# EAGLE design Driver Board v2 (EAGLE 9.6.2)
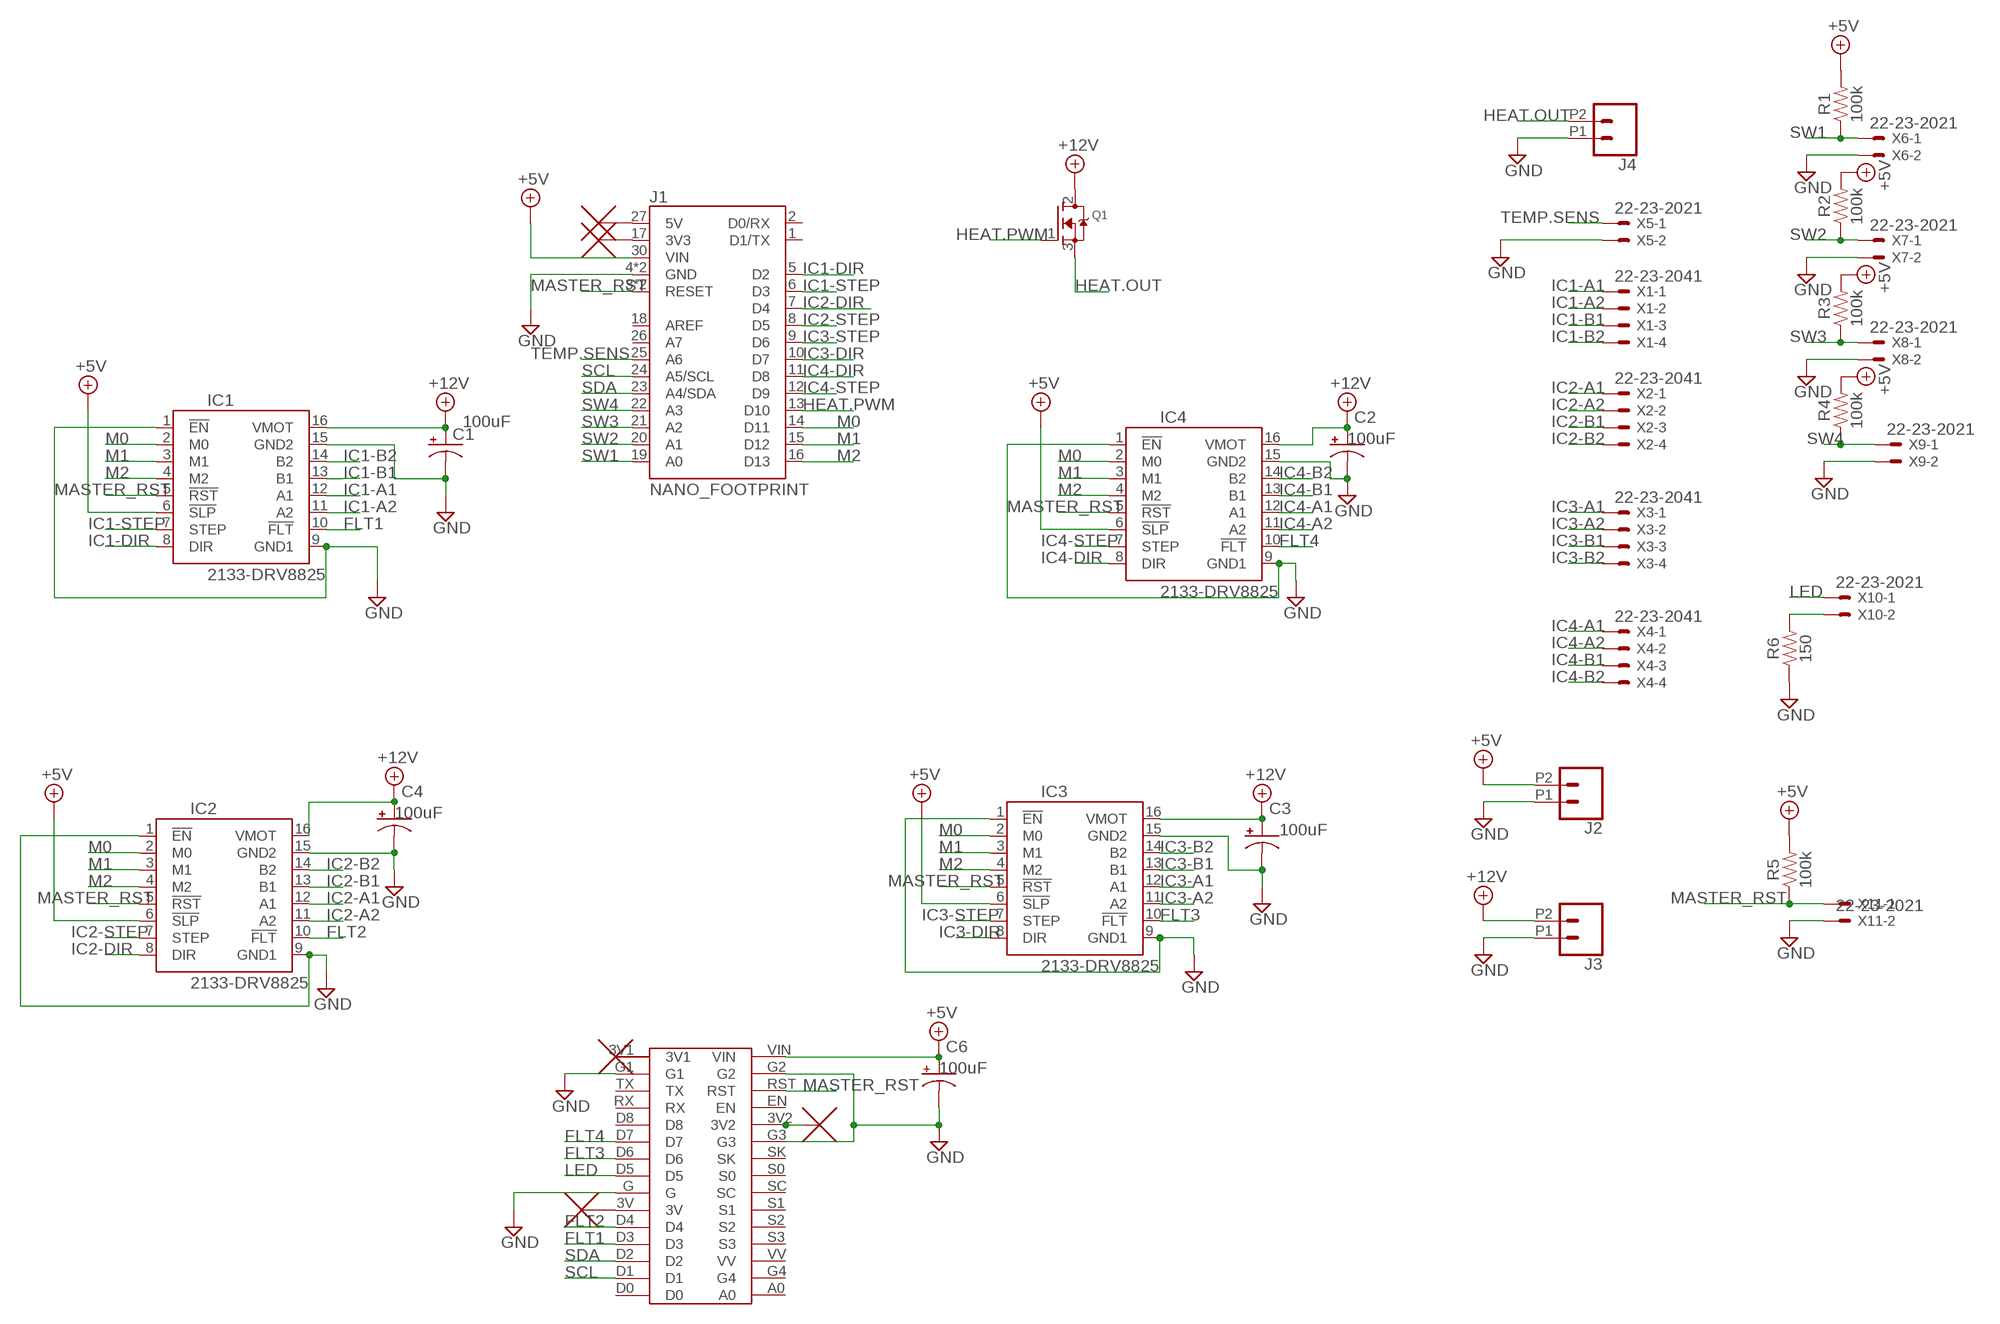
[diagram p0: schematic, sheet 1]

## Parts
C1  CPOL-USD  [PANASONIC_D]
C2  CPOL-USD  [PANASONIC_D]
C3  CPOL-USD  [PANASONIC_D]
C4  CPOL-USD  [PANASONIC_D]
C6  CPOL-USD  [PANASONIC_D]
IC1  2133-DRV8825  [DRV8825]
IC2  2133-DRV8825  [DRV8825]
IC3  2133-DRV8825  [DRV8825]
IC4  2133-DRV8825  [DRV8825]
J1  NANO_FOOTPRINT  [NANO]
J2  CONN_02SCREWTERMINAL-6.35MM-2  [1X02_6.35_SCREWTERM]
J3  CONN_02SCREWTERMINAL-6.35MM-2  [1X02_6.35_SCREWTERM]
J4  CONN_02SCREWTERMINAL-6.35MM-2  [1X02_6.35_SCREWTERM]
Q1  MOSFET-NGDS_TO220V  [TO220V]
R1  100k  0.22OHM-0805-1/4W-1%  [0805]
R2  100k  0.22OHM-0805-1/4W-1%  [0805]
R3  100k  0.22OHM-0805-1/4W-1%  [0805]
R4  100k  0.22OHM-0805-1/4W-1%  [0805]
R5  100k  0.22OHM-0805-1/4W-1%  [0805]
R6  150  0.22OHM-0805-1/4W-1%  [0805]
U$4  NC_MARKER  (no package)
U$5  NC_MARKER  (no package)
U$6  LOLIN  [LOLIN]
U$7  NC_MARKER  (no package)
U$8  NC_MARKER  (no package)
U$9  NC_MARKER  (no package)
X1  22-23-2041  [22-23-2041]
X2  22-23-2041  [22-23-2041]
X3  22-23-2041  [22-23-2041]
X4  22-23-2041  [22-23-2041]
X5  22-23-2021  [22-23-2021]
X6  22-23-2021  [22-23-2021]
X7  22-23-2021  [22-23-2021]
X8  22-23-2021  [22-23-2021]
X9  22-23-2021  [22-23-2021]
X10  22-23-2021  [22-23-2021]
X11  22-23-2021  [22-23-2021]

## Nets
+5V: IC1.6(!SLP) IC2.6(!SLP) IC3.6(!SLP) IC4.6(!SLP) J1.30(VIN) J2.P2 R1.2 R2.2 R3.2 R4.2 R5.2
+5V1: C6.+ U$6.VIN ; supply symbol labelled +5V
+12V: C1.+ C2.+ C3.+ C4.+ IC1.16(VMOT) IC2.16(VMOT) IC3.16(VMOT) IC4.16(VMOT) J3.P2 Q1.2(D)
FLT1: IC1.10(!FLT) U$6.D3
FLT2: IC2.10(!FLT) U$6.D4
FLT3: IC3.10(!FLT) U$6.D6
FLT4: IC4.10(!FLT) U$6.D7
GND: C1.- C2.- C3.- C4.- IC1.1(!EN) IC1.9(GND1) IC1.15(GND2) IC2.1(!EN) IC2.9(GND1) IC2.15(GND2) IC3.1(!EN) IC3.9(GND1) IC3.15(GND2) IC4.1(!EN) IC4.9(GND1) IC4.15(GND2) J1.4(GND) J1.29(GND) J2.P1 J3.P1 J4.P1 R6.1 U$6.G U$6.G1 X5.2 X6.2 X7.2 X8.2 X9.2 X11.2
GND1: C6.- U$6.G2 U$6.G3 ; supply symbol labelled GND
HEAT.OUT: J4.P2 Q1.3(S)
HEAT.PWM: J1.13(D10) Q1.1(G)
IC1-A1: IC1.12(A1) X1.1
IC1-A2: IC1.11(A2) X1.2
IC1-B1: IC1.13(B1) X1.3
IC1-B2: IC1.14(B2) X1.4
IC1-DIR: IC1.8(DIR) J1.5(D2)
IC1-STEP: IC1.7(STEP) J1.6(D3)
IC2-A1: IC2.12(A1) X2.1
IC2-A2: IC2.11(A2) X2.2
IC2-B1: IC2.13(B1) X2.3
IC2-B2: IC2.14(B2) X2.4
IC2-DIR: IC2.8(DIR) J1.7(D4)
IC2-STEP: IC2.7(STEP) J1.8(D5)
IC3-A1: IC3.12(A1) X3.1
IC3-A2: IC3.11(A2) X3.2
IC3-B1: IC3.13(B1) X3.3
IC3-B2: IC3.14(B2) X3.4
IC3-DIR: IC3.8(DIR) J1.10(D7)
IC3-STEP: IC3.7(STEP) J1.9(D6)
IC4-A1: IC4.12(A1) X4.1
IC4-A2: IC4.11(A2) X4.2
IC4-B1: IC4.13(B1) X4.3
IC4-B2: IC4.14(B2) X4.4
IC4-DIR: IC4.8(DIR) J1.11(D8)
IC4-STEP: IC4.7(STEP) J1.12(D9)
LED: U$6.D5 X10.1
M0: IC1.2(M0) IC2.2(M0) IC3.2(M0) IC4.2(M0) J1.14(D11)
M1: IC1.3(M1) IC2.3(M1) IC3.3(M1) IC4.3(M1) J1.15(D12)
M2: IC1.4(M2) IC2.4(M2) IC3.4(M2) IC4.4(M2) J1.16(D13)
MASTER_RST: IC1.5(!RST) IC2.5(!RST) IC3.5(!RST) IC4.5(!RST) J1.3(RESET) J1.28(RESET) R5.1 U$6.RST X11.1
N$3: J1.27(5V) U$4.P$1
N$4: J1.17(3V3) U$5.P$1
N$9: R6.2 X10.2
N$16: U$6.3V2 U$8.P$1
N$17: U$6.3V U$9.P$1
SCL: J1.24(A5/SCL) U$6.D1
SDA: J1.23(A4/SDA) U$6.D2
SW1: J1.19(A0) R1.1 X6.1
SW2: J1.20(A1) R2.1 X7.1
SW3: J1.21(A2) R3.1 X8.1
SW4: J1.22(A3) R4.1 X9.1
TEMP.SENS: J1.25(A6) X5.1
Unconnected: J1.1(D1/TX) J1.2(D0/RX) J1.18(AREF) J1.26(A7) U$6.3V1 U$6.A0 U$6.D0 U$6.D8 U$6.EN U$6.G4 U$6.RX U$6.S0 U$6.S1 U$6.S2 U$6.S3 U$6.SC U$6.SK U$6.TX U$6.VV U$7.P$1

## Library data of the parts
C1-C4 C6 = adafruit:CPOL-US: POLARIZED CAPACITOR, American symbol; C: 100uF
IC1-IC4 = pololu-stepper-driver:2133-DRV8825: DRV8825 Stepper Motor Driver Carrier, High Current #2133 DRV8825 Stepper Motor Driver Carrier; High Current <https://www.pololu.com/product/2133> in Japan, Suzaku Lab. Ltd. <https://suzakugiken.jp/> #2133 DRV8825 大電流用ステッピングモータドライバ <https://szc.jp/po2133>
J1 = SparkFun-Boards:NANO_FOOTPRINT: Generic Nano Footprint
J2-J4 = SparkFun-Connectors:CONN_02: Multi connection point. Often used as Generic Header-pin footprint for 0.1 inch spaced/style header connections On any of the 0.1 inch spaced packages, you can populate with these: Break Away Headers - Straight <https://www.sparkfun.com/products/116> (PRT-00116) Break Away Male Headers - Right Angle <https://www.sparkfun.com/products/553> (PRT-00553) Female Headers <https://www.sparkfun.com/products/115> (PRT-00115) Break Away Headers - Machine Pin <https://www.sparkfun.com/products/117> (PRT-00117) Break Away Female Headers - Swiss Machine Pin <https://www.sparkfun.com/products/743> (PRT-00743) For SCREWTERMINALS and SPRING TERMINALS visit here: Screw Terimnals on SparkFun.com <https://www.sparkfun.com/search/results?term=Screw+Terminals> (5mm/3.5mm/2.54mm spacing) This device is also useful as a general connection point to wire up your design to another part of your project. Our various solder wires solder well into these plated through hole pads. Hook-Up Wire - Assortment (Stranded, 22 AWG) <https://www.sparkfun.com/products/11375> (PRT-11375) Hook-Up Wire - Assortment (Solid Core, 22 AWG) <https://www.sparkfun.com/products/11367> (PRT-11367) View the entire wire category on our website here <https://www.sparkfun.com/categories/141> Special notes: Molex polarized connector foot print use with: PRT-08233 with associated crimp pins and housings. 2.54_SCREWTERM for use with PRT-10571. 3.5mm Screw Terminal footprints for PRT-08084 5mm Screw Terminal footprints for use with PRT-08432; PROD_ID: CONN-15154
Q1 = adafruit:MOSFET-N: N-Channel Mosfet 2N7002E - 60V 260mA SOT23 [Digikey: 2N7002ET1GOSTR-ND] - REEL BSH103 - 30V 850mA SOT23 [Digikey: 568-5013-1-ND]
R1-R6 = SparkFun-Resistors:0.22OHM: 0.22Ω resistor A resistor is a passive two-terminal electrical component that implements electrical resistance as a circuit element. Resistors act to reduce current flow, and, at the same time, act to lower voltage levels within circuits. - Wikipedia; PROD_ID: RES-09883; VALUE: 0.22
U$4 U$5 U$7-U$9 = NC_MARKER:NC_MARKER
U$6 = Lolin:LOLIN
X1-X4 = con-molex:22-23-2041: .100" (2.54mm) Center Header - 4 Pin; MF: MOLEX; MPN: 22-23-2041; OC_FARNELL: 1462920; OC_NEWARK: 38C0355
X5-X11 = con-molex:22-23-2021: .100" (2.54mm) Center Header - 2 Pin; MF: MOLEX; MPN: 22-23-2021; OC_FARNELL: 1462926; OC_NEWARK: 25C3832

## Board
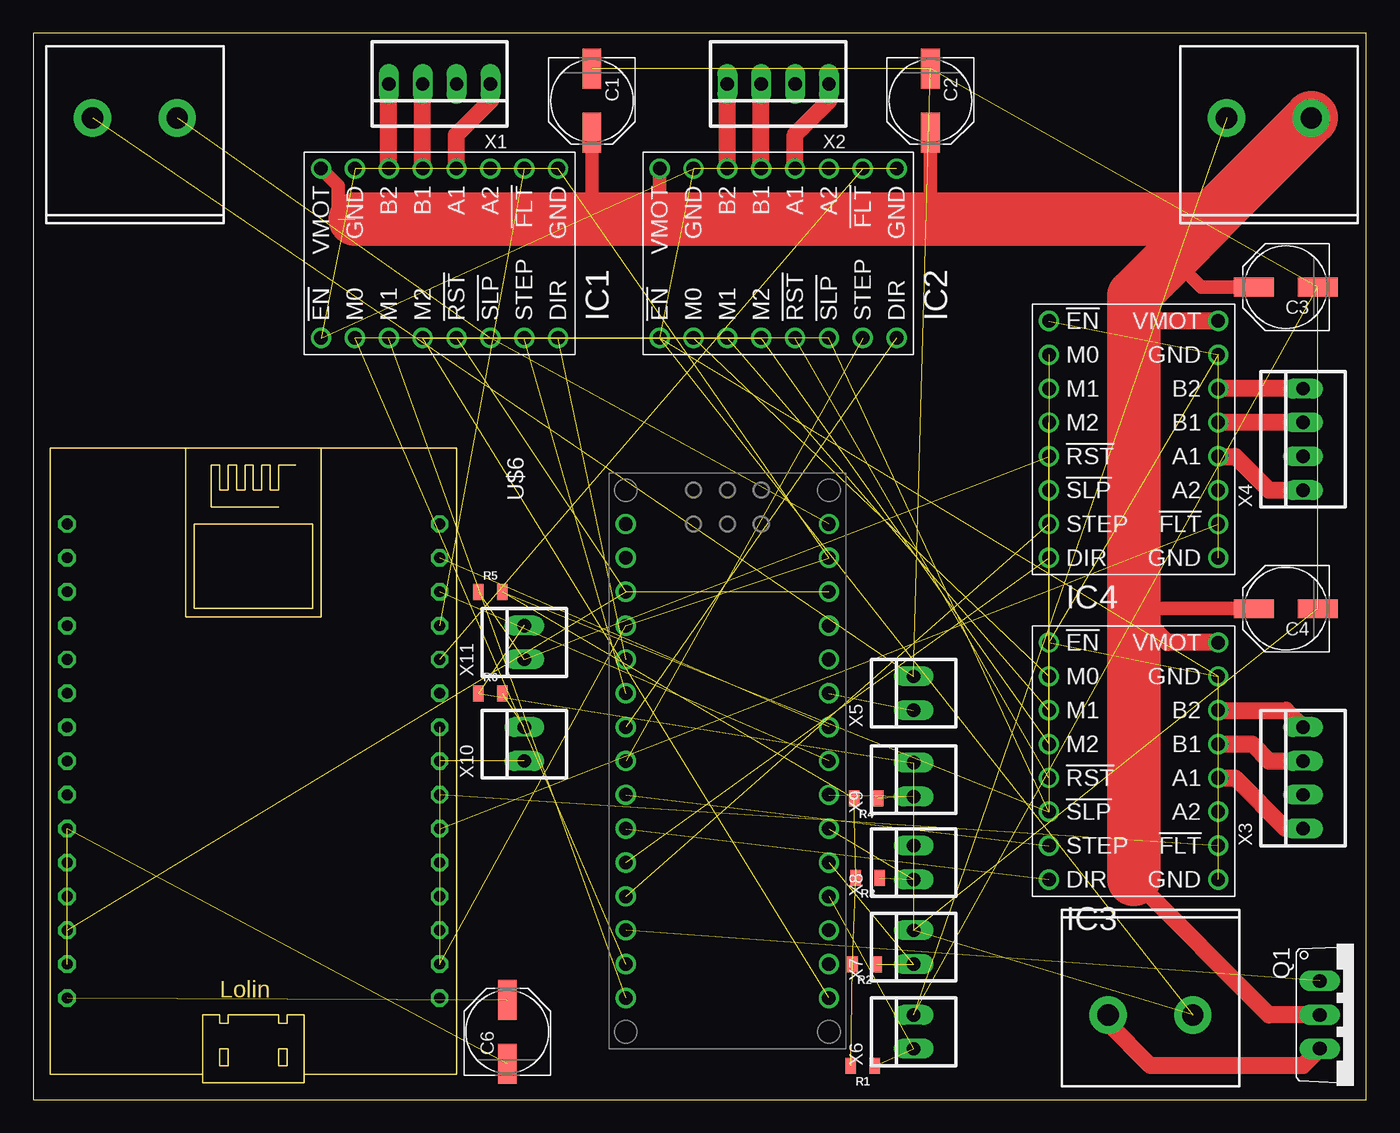
[diagram p1: board, top side]
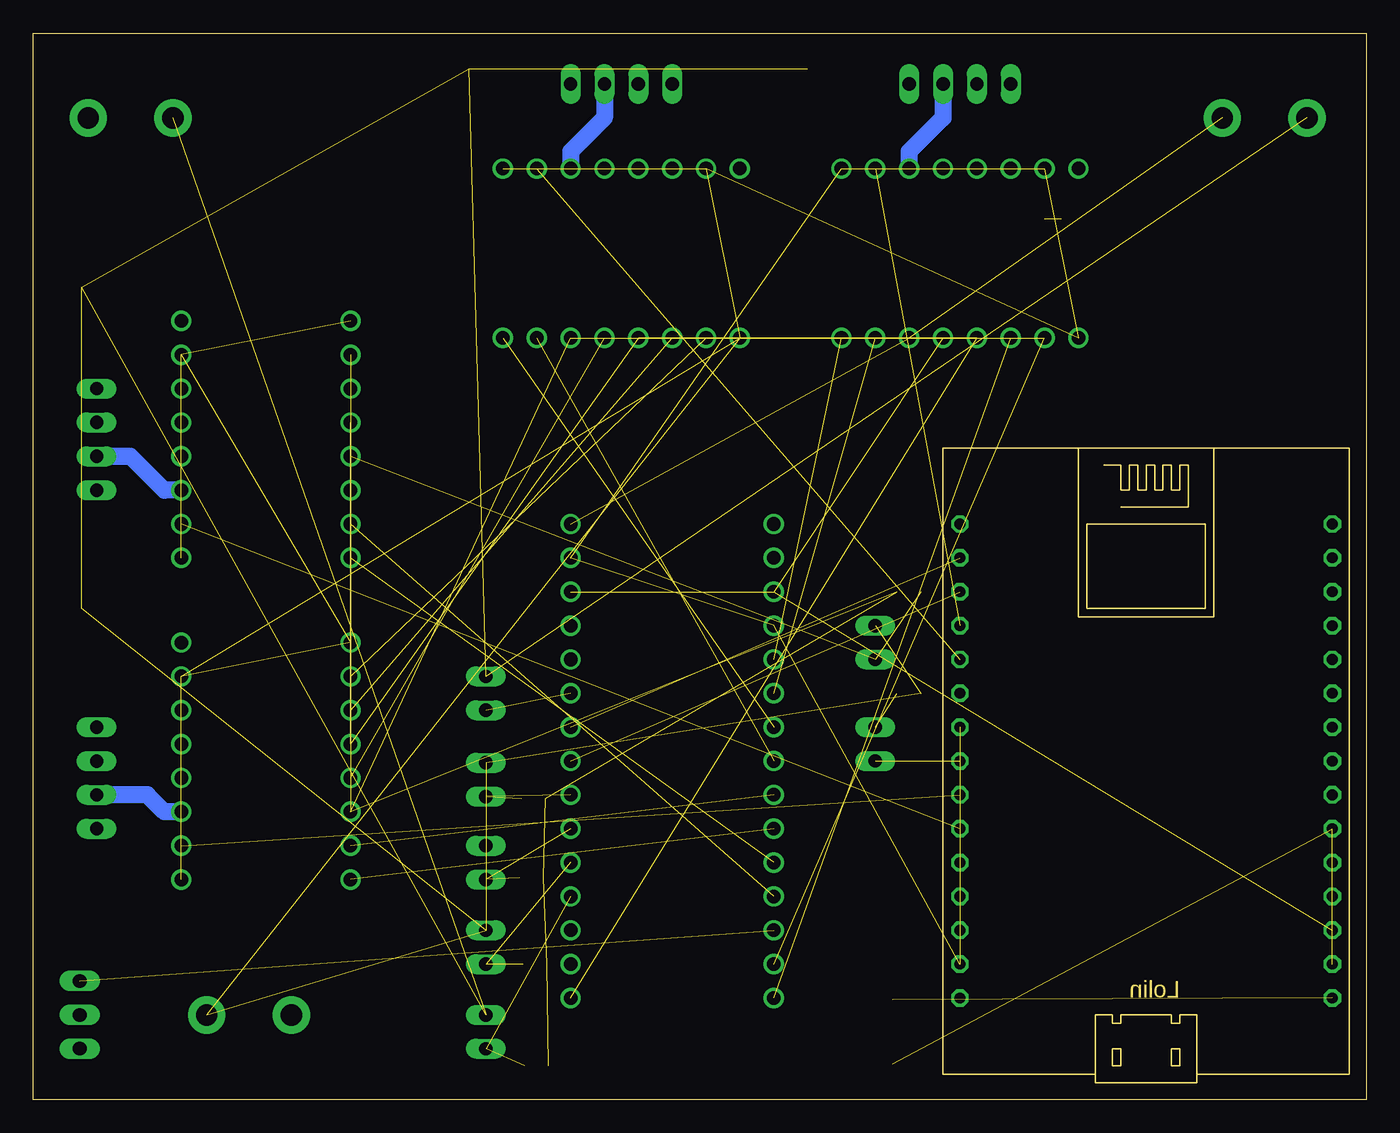
[diagram p2: board, bottom side, seen from below]

Size 100 x 80 mm. Coordinates in mm from the lower left corner, seen from the top.
Outline: 0,0 100,0 100,80 0,80 0,0
Copper layers (1*16): Top 0.035mm / dielectric 1.5mm / Bottom 0.035mm
Design rules "default": minimum track width 6mil, minimum drill 0.35mm, track to track 6mil, track to pad 6mil, pad to pad 6mil, via to via 6mil, smd to smd 6mil, copper to edge 40mil, drill to drill 6mil, minimum pad ring 10mil, minimum via ring 8mil, stop-mask expansion 4mil, vias tented up to drill 0mil, thermal gap 10mil

### Footprints (pad centres in the part's own frame; a part is rotated, then mirrored left to right if it is on the bottom)
PANASONIC_D = smd 3 x 1.4: + 2.4,0; - -2.4,0
DRV8825 = drill 1.016: 1 -6.35,8.89; 2 -6.35,6.35; 3 -6.35,3.81; 4 -6.35,1.27; 5 -6.35,-1.27; 6 -6.35,-3.81; 7 -6.35,-6.35; 8 -6.35,-8.89; 9 6.35,-8.89; 10 6.35,-6.35; 11 6.35,-3.81; 12 6.35,-1.27; 13 6.35,1.27; 14 6.35,3.81; 15 6.35,6.35; 16 6.35,8.89
NANO = drill 1.016: 1 -7.62,17.78; 2 -7.62,15.24; 3 -7.62,12.7; 4 -7.62,10.16; 5 -7.62,7.62; 6 -7.62,5.08; 7 -7.62,2.54; 8 -7.62,0; 9 -7.62,-2.54; 10 -7.62,-5.08; 11 -7.62,-7.62; 12 -7.62,-10.16; 13 -7.62,-12.7; 14 -7.62,-15.24; 15 -7.62,-17.78; 16 7.62,-17.78; 17 7.62,-15.24; 18 7.62,-12.7; 19 7.62,-10.16; 20 7.62,-7.62; 21 7.62,-5.08; 22 7.62,-2.54; 23 7.62,0; 24 7.62,2.54; 25 7.62,5.08; 26 7.62,7.62; 27 7.62,10.16; 28 7.62,12.7; 29 7.62,15.24; 30 7.62,17.78
1X02_6.35_SCREWTERM = drill 1.6 pad 2.8: P1 -3.175,0; P2 3.175,0
TO220V = drill 1.016 long: 1 -2.54,-2.54; 2 0,-2.54; 3 2.54,-2.54
0805 = smd 0.8 x 1.2: 1 -0.9,0; 2 0.9,0
LOLIN = drill 0.8 octagon: 3V -6.35,13.97; 3V1 16.51,13.97; 3V2 6.35,-13.97; A0 -19.05,-13.97; D0 -19.05,13.97; D1 -16.51,13.97; D2 -13.97,13.97; D3 -11.43,13.97; D4 -8.89,13.97; D5 -1.27,13.97; D6 1.27,13.97; D7 3.81,13.97; D8 6.35,13.97; EN 8.89,-13.97; G -3.81,13.97; G1 13.97,13.97; G2 13.97,-13.97; G3 3.81,-13.97; G4 -16.51,-13.97; RST 11.43,-13.97; RX 8.89,13.97; S0 -1.27,-13.97; S1 -6.35,-13.97; S2 -8.89,-13.97; S3 -11.43,-13.97; SC -3.81,-13.97; SK 1.27,-13.97; TX 11.43,13.97; VIN 16.51,-13.97; VV -13.97,-13.97
22-23-2041 = drill 1 long: 1 -3.81,0; 2 -1.27,0; 3 1.27,0; 4 3.81,0
22-23-2021 = drill 1 long: 1 -1.27,0; 2 1.27,0

### Placement (x,y rotation side)
C1  41.91,74.93 270 top
C2  67.31,74.93 270 top
C3  93.98,60.96 180 top
C4  93.98,36.83 180 top
C6  35.56,5.08 90 top
IC1  30.48,63.5 90 top
IC2  55.88,63.5 90 top
IC3  82.55,25.4 0 top
IC4  82.55,49.53 0 top
J1  52.07,25.4 0 top
J2  7.62,73.66 0 top
J3  92.71,73.66 0 top
J4  83.82,6.35 180 top
Q1  99.06,6.35 270 top
R1  62.23,2.54 180 top
R2  62.36,10.16 180 top
R3  62.61,16.64 180 top
R4  62.48,22.61 180 top
R5  34.29,38.1 0 top
R6  34.29,30.48 0 top
U$6  16.51,24.13 270 top
X1  30.48,76.2 180 top
X2  55.88,76.2 180 top
X3  95.25,24.13 90 top
X4  95.25,49.53 90 top
X5  66.04,30.48 90 top
X6  66.04,5.08 90 top
X7  66.04,11.43 90 top
X8  66.04,17.78 90 top
X9  66.04,24 90 top
X10  36.83,26.67 90 top
X11  36.83,34.29 90 top

### Tracks (layer width: path | path; a pad name or v marks a point on that pad's centre or on a via)
+5V  (10 unrouted)
+5V1  (1 unrouted)
+12V  (1 unrouted)
  Top 1.016: IC1.16 22.86,68.58 22.86,66.04 | IC2.16 46.99,67.31 45.72,66.04 | C1.+ 41.91,66.04 | C2.+ 67.31,66.04 | C3.+ 87.63,60.96 85.41,63.18 | C4.+ 82.55,36.83
  Top 1.27: Q1.2 92.71,6.35 82.55,16.51 | IC4.16 84.45,58.42 82.55,60.33 | IC3.16 85.09,34.29 82.55,36.83
  Top 4: J3.P2 88.27,66.04 | 88.27,66.04 67.31,66.04 45.72,66.04 41.91,66.04 24.13,66.04 | 88.27,66.04 85.41,63.18 82.55,60.33 82.55,36.83 82.55,16.51
FLT1  (1 unrouted)
FLT2  (1 unrouted)
FLT3  (1 unrouted)
FLT4  (1 unrouted)
GND  (29 unrouted)
GND1  (2 unrouted)
HEAT.OUT
  Top 1.27: Q1.3 95.25,2.54 83.82,2.54 80.64,5.71 J4.P2
HEAT.PWM  (1 unrouted)
IC1-A1
  Top 1.27: IC1.12 31.75,72.39 34.29,74.93 X1.1
IC1-A2
  Bottom 1.27: X1.2 31.75,73.66 34.29,71.12 IC1.11
IC1-B1
  Top 1.27: IC1.13 X1.3
IC1-B2
  Top 1.27: IC1.14 X1.4
IC1-DIR  (1 unrouted)
IC1-STEP  (1 unrouted)
IC2-A1
  Top 1.27: IC2.12 57.15,72.39 59.69,74.93 X2.1
IC2-A2
  Bottom 1.27: X2.2 57.15,73.66 59.69,71.12 IC2.11
IC2-B1
  Top 1.27: IC2.13 X2.3
IC2-B2
  Top 1.27: IC2.14 X2.4
IC2-DIR  (1 unrouted)
IC2-STEP  (1 unrouted)
IC3-A1
  Top 1.27: IC3.12 90.17,24.13 93.98,20.32 X3.1
IC3-A2
  Bottom 1.27: IC3.11 90.17,21.59 91.44,22.86 X3.2
IC3-B1
  Top 1.27: IC3.13 91.44,26.67 92.71,25.4 X3.3
IC3-B2
  Top 1.27: IC3.14 93.98,29.21 X3.4
IC3-DIR  (1 unrouted)
IC3-STEP  (1 unrouted)
IC4-A1
  Top 1.27: IC4.12 90.17,48.26 92.71,45.72 X4.1
IC4-A2
  Bottom 1.27: IC4.11 90.17,45.72 92.71,48.26 X4.2
IC4-B1
  Top 1.27: X4.3 IC4.13
IC4-B2
  Top 1.27: X4.4 IC4.14
IC4-DIR  (1 unrouted)
IC4-STEP  (1 unrouted)
LED  (1 unrouted)
M0  (4 unrouted)
M1  (4 unrouted)
M2  (4 unrouted)
MASTER_RST  (8 unrouted)
N$9  (1 unrouted)
SCL  (1 unrouted)
SDA  (1 unrouted)
SW1  (2 unrouted)
SW2  (2 unrouted)
SW3  (2 unrouted)
SW4  (2 unrouted)
TEMP.SENS  (1 unrouted)